# EAGLE design Arduino PCD8544 (EAGLE 8.0.0)
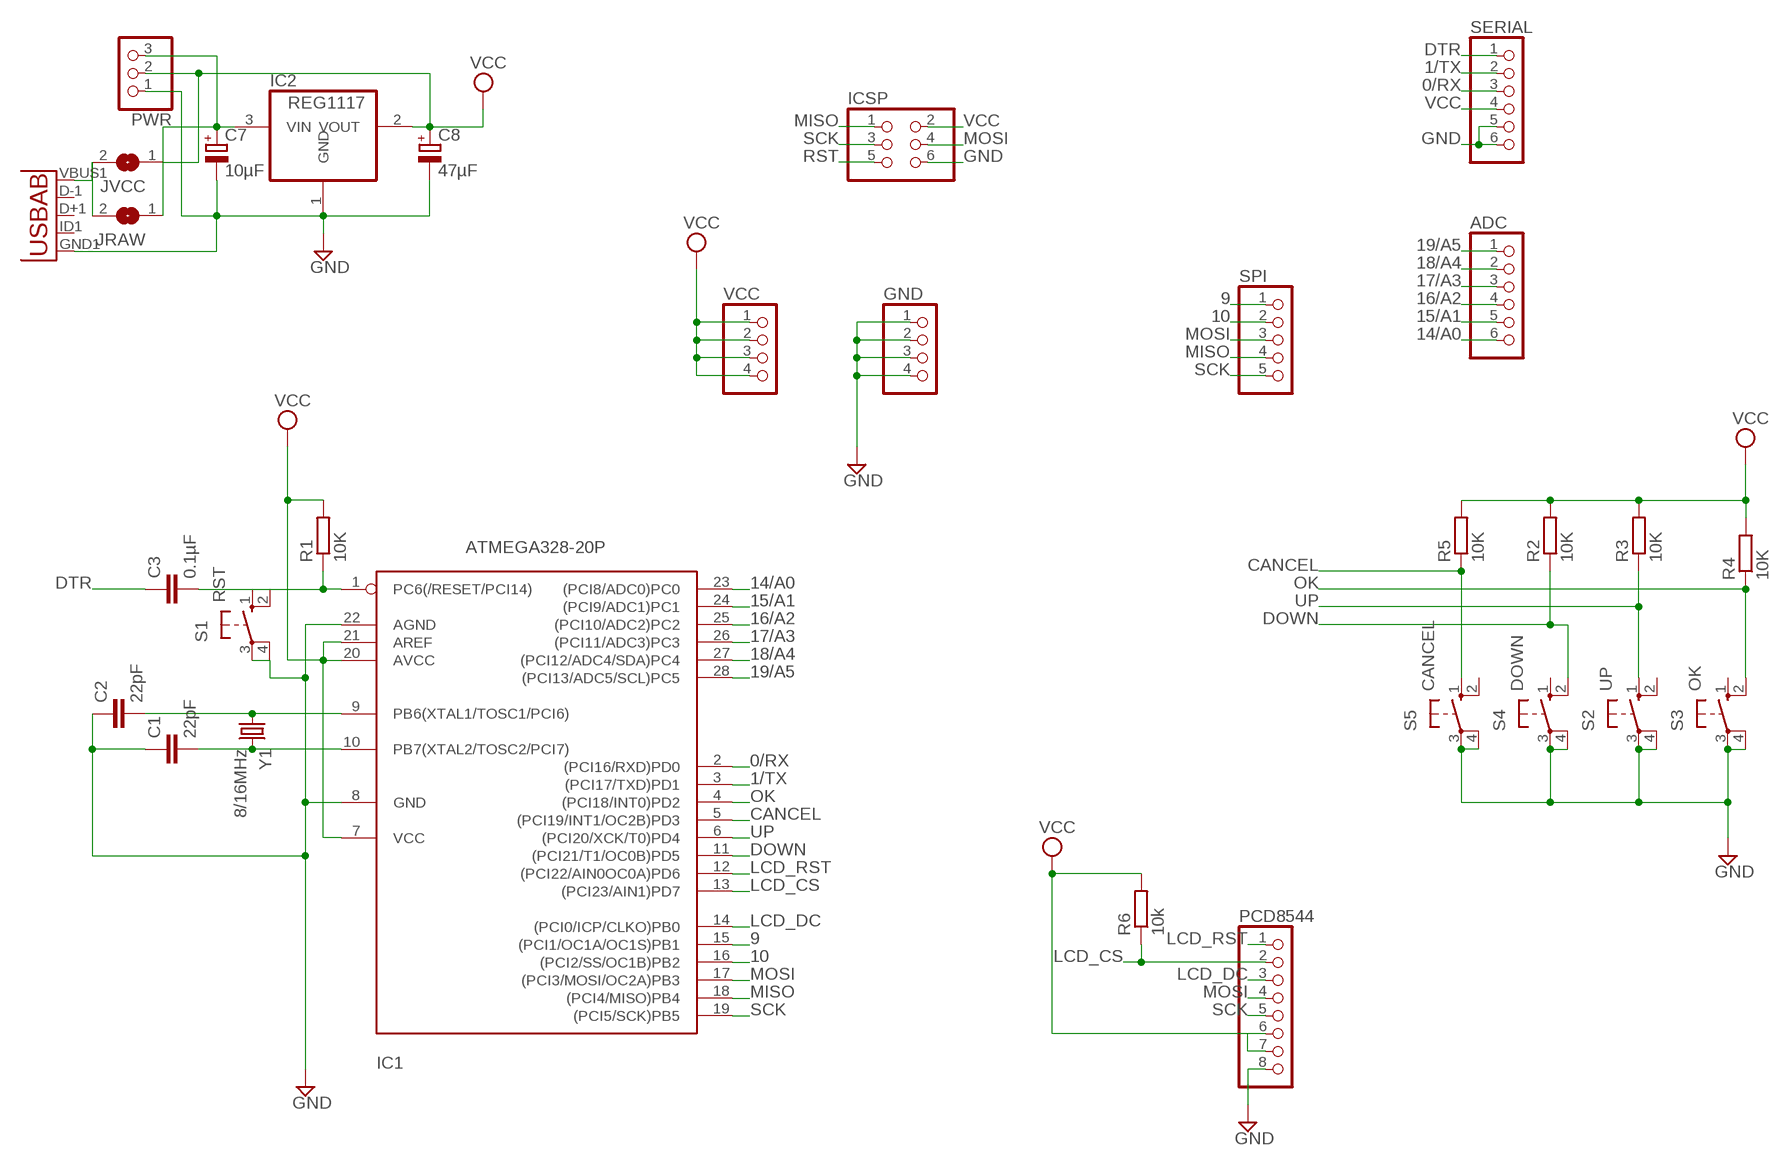
[diagram p0: schematic, sheet 1]

## Parts
ADC  PINHD-1X6  [1X06]
C1  22pF  C-EUC0805  [C0805]
C2  22pF  C-EUC0805  [C0805]
C3  0.1µF  C-EUC0805  [C0805]
C7  10µF  CPOL-EUE2.5-5  [E2,5-5]
C8  47µF  CPOL-EUE2.5-5  [E2,5-5]
GND  PINHD-1X4  [1X04]
IC1  ATMEGA328-20P  [DIL28-3]
IC2  REG1117  [SOT223]
ICSP  PINHD-2X3  [2X03]
JRAW  SJ  [SJ]
JVCC  SJ  [SJ]
PCD8544  PINHD-1X8  [1X08]
PWR  PINHD-1X3  [1X03]
R1  10K  R-EU_R0805  [R0805]
R2  10K  R-EU_R0805  [R0805]
R3  10K  R-EU_R0805  [R0805]
R4  10K  R-EU_R0805  [R0805]
R5  10K  R-EU_R0805  [R0805]
R6  10k  R-EU_R0805  [R0805]
S1  RST  10-XX  [B3F-10XX]
S2  UP  10-XX  [B3F-10XX]
S3  OK  10-XX  [B3F-10XX]
S4  DOWN  10-XX  [B3F-10XX]
S5  CANCEL  10-XX  [B3F-10XX]
SERIAL  PINHD-1X6  [1X06]
SPI  PINHD-1X5  [1X05]
U1  USB""  [USB-MICRO-SMD]
VCC  PINHD-1X4  [1X04]
Y1  8/16MHz  CRYSTALHC49US  [HC49US]

## Nets
0/RX: IC1.2((PCI16/RXD)PD0) SERIAL.3
1/TX: IC1.3((PCI17/TXD)PD1) SERIAL.2
9: IC1.15((PCI1/OC1A/OC1S)PB1) SPI.1
10: IC1.16((PCI2/SS/OC1B)PB2) SPI.2
14/A0: ADC.6 IC1.23((PCI8/ADC0)PC0)
15/A1: ADC.5 IC1.24((PCI9/ADC1)PC1)
16/A2: ADC.4 IC1.25((PCI10/ADC2)PC2)
17/A3: ADC.3 IC1.26((PCI11/ADC3)PC3)
18/A4: ADC.2 IC1.27((PCI12/ADC4/SDA)PC4)
19/A5: ADC.1 IC1.28((PCI13/ADC5/SCL)PC5)
CANCEL: IC1.5((PCI19/INT1/OC2B)PD3) R5.1 S5.1(S)
DOWN: IC1.11((PCI21/T1/OC0B)PD5) R2.1 S4.2(S1)
DTR: C3.1 SERIAL.1
GND: C1.1 C2.1 C7.- C8.- GND.1 GND.2 GND.3 GND.4 IC1.8(GND) IC1.22(AGND) IC2.1(GND) ICSP.6 PCD8544.8 PWR.1 S1.3(P) S1.4(P1) S2.3(P) S2.4(P1) S3.3(P) S3.4(P1) S4.3(P) S4.4(P1) S5.3(P) S5.4(P1) SERIAL.5 SERIAL.6 U1.GND1(GND)
LCD_CS: IC1.13((PCI23/AIN1)PD7) PCD8544.2 R6.1
LCD_DC: IC1.14((PCI0/ICP/CLKO)PB0) PCD8544.3
LCD_RST: IC1.12((PCI22/AIN0OC0A)PD6) PCD8544.1
MISO: IC1.18((PCI4/MISO)PB4) ICSP.1 SPI.4
MOSI: IC1.17((PCI3/MOSI/OC2A)PB3) ICSP.4 PCD8544.4 SPI.3
N$1: JRAW.2 JVCC.2 U1.VBUS1(VBUS)
OK: IC1.4((PCI18/INT0)PD2) R4.1 S3.2(S1)
RAW: C7.+ IC2.3(VIN) JRAW.1 PWR.3
RST: C3.2 IC1.1(PC6(/RESET/PCI14)) ICSP.5 R1.1 S1.1(S) S1.2(S1)
SCK: IC1.19((PCI5/SCK)PB5) ICSP.3 PCD8544.5 SPI.5
UP: IC1.6((PCI20/XCK/T0)PD4) R3.1 S2.1(S)
VCC: C8.+ IC1.7(VCC) IC1.20(AVCC) IC1.21(AREF) IC2.2(VOUT) ICSP.2 JVCC.1 PCD8544.6 PCD8544.7 PWR.2 R1.2 R2.2 R3.2 R4.2 R5.2 R6.2 SERIAL.4 VCC.1 VCC.2 VCC.3 VCC.4
XTAL1: C2.2 IC1.9(PB6(XTAL1/TOSC1/PCI6)) Y1.1
XTAL2: C1.2 IC1.10(PB7(XTAL2/TOSC2/PCI7)) Y1.2
Unconnected: S2.2(S1) S3.1(S) S4.1(S) S5.2(S1) U1.D+1(D+) U1.D-1(D-) U1.ID1(USBID)

## Library data of the parts
ADC SERIAL = pinhead:PINHD-1X6: PIN HEADER
C1-C3 = resistor:C-EU: CAPACITOR, European symbol
C7 C8 = resistor:CPOL-EU: POLARIZED CAPACITOR, European symbol
GND VCC = pinhead:PINHD-1X4: PIN HEADER
IC1 = atmega328:ATMEGA328*P: MICROCONTROLLER 32 kBytes FLASH 2 kBytes SRAM 1 kBytes EEPROM USART 8-channel 10 bit ADC
IC2 = burr-brown:REG1117: 800mA and 1A Low Dropout (LDO) Positive Regulator 1.8V, 2.5V, 2.85V, 3.3V, 5V, and Adj; MPN: REG1117; OC_FARNELL: 1097566; OC_NEWARK: 14P6981
ICSP = pinhead:PINHD-2X3: PIN HEADER
JRAW JVCC = jumper:SJ: SMD solder JUMPER
PCD8544 = pinhead:PINHD-1X8: PIN HEADER
PWR = pinhead:PINHD-1X3: PIN HEADER
R1 = rcl:R-EU_: RESISTOR, European symbol
R2-R6 = resistor:R-EU_: RESISTOR, European symbol
S1-S5 = switch-omron:10-XX: OMRON SWITCH; MPN: B3F-1000; OC_FARNELL: 176432; OC_NEWARK: 36M3542
SPI = pinhead:PINHD-1X5: PIN HEADER
U1 = MicroUSB:USB: This is a USB AB connector that is compatible with USB OTG. i.e. this connector can serve as a host or device
Y1 = SparkFun-FreqCtrl:CRYSTAL: Various standard crystals. Proven footprints.

## Board
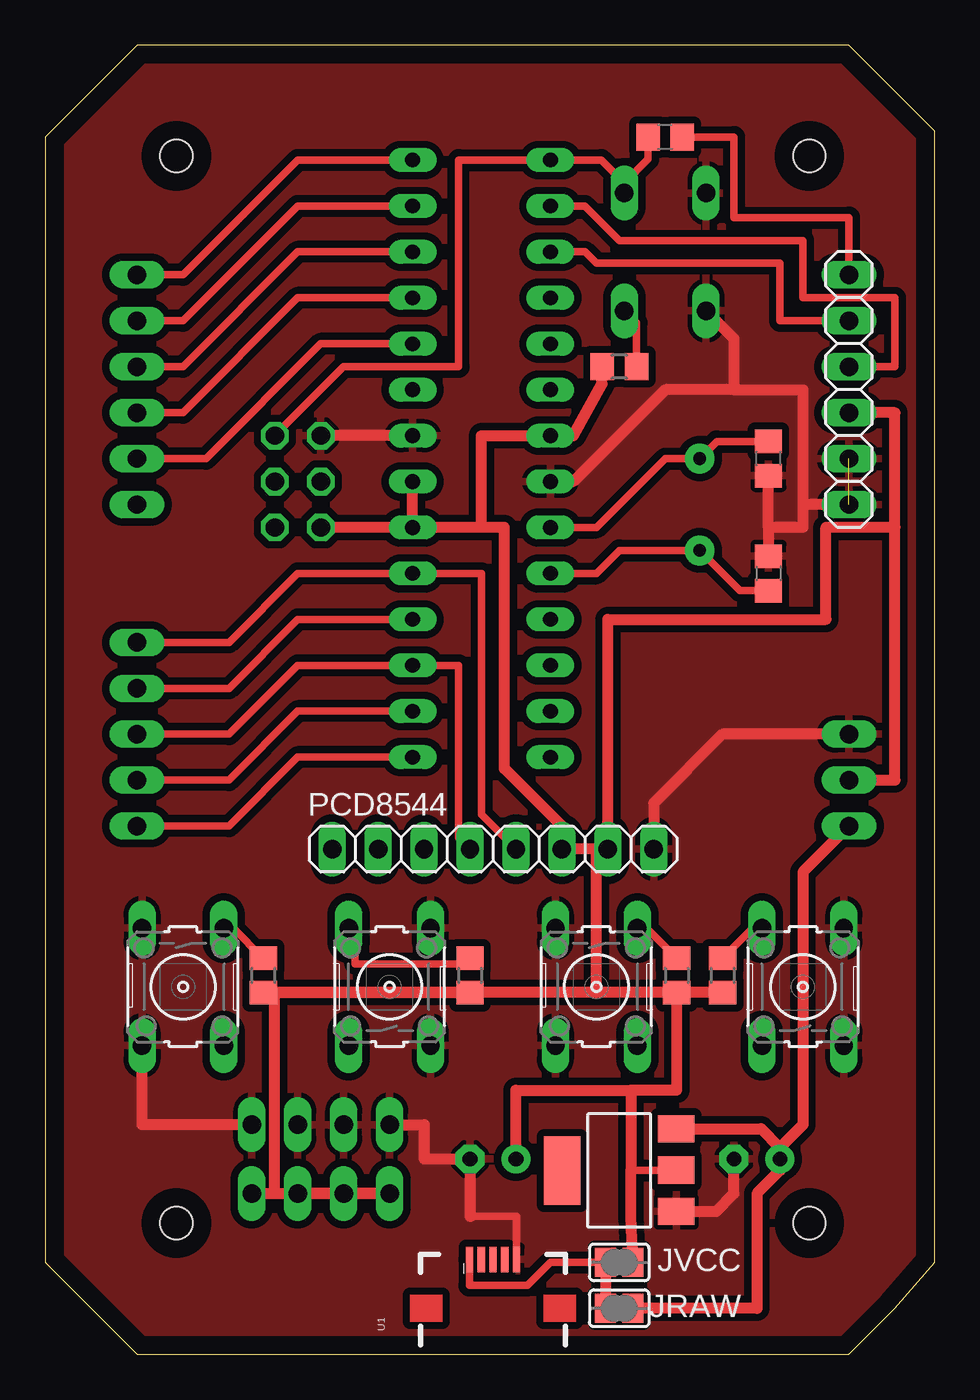
[diagram p1: board, top side]
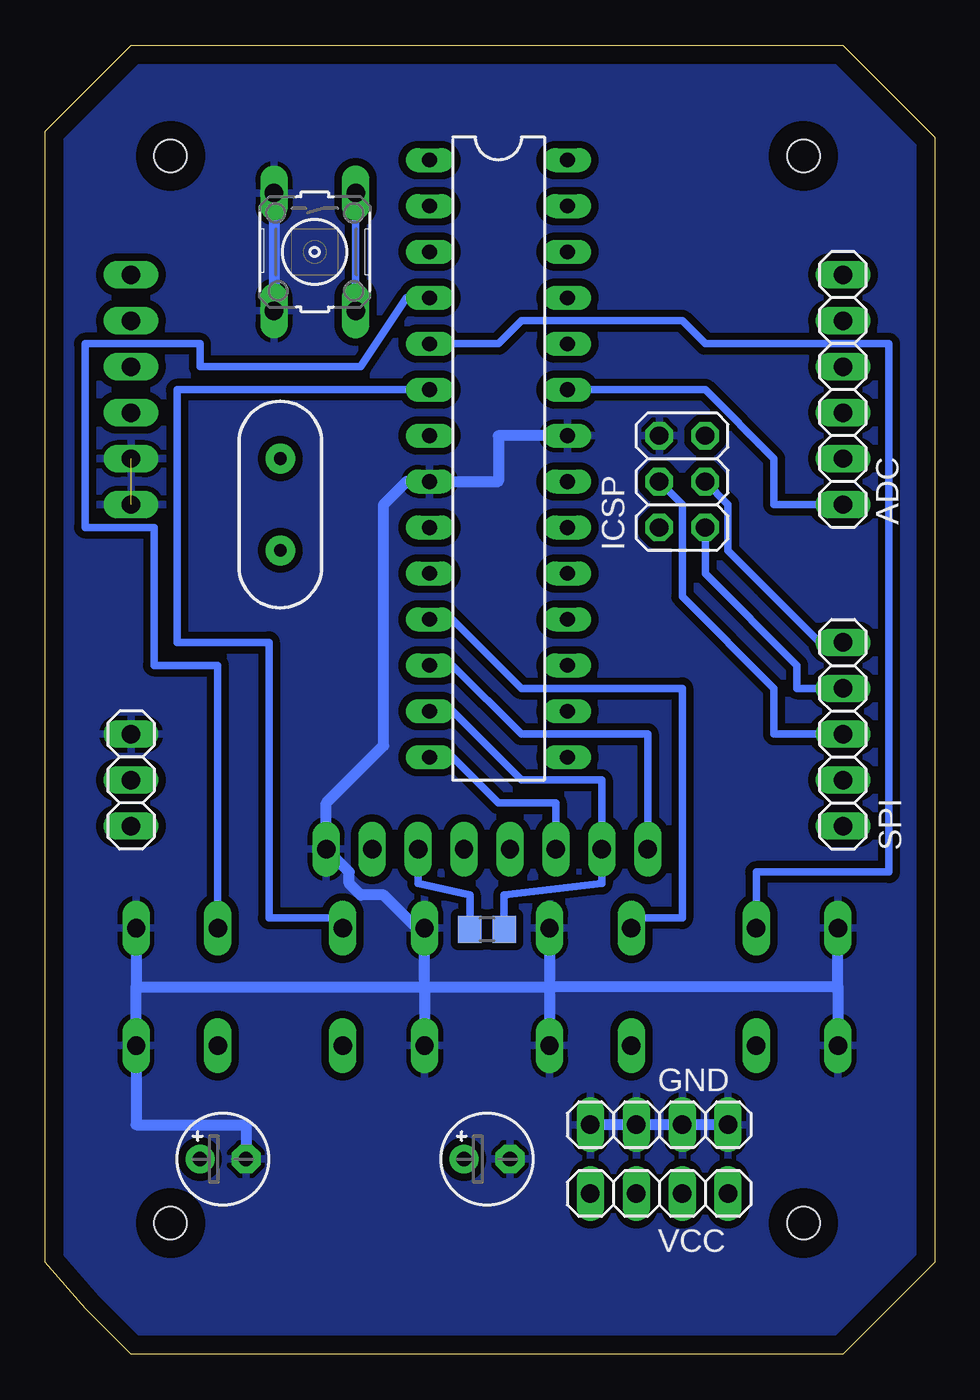
[diagram p2: board, bottom side, seen from below]

Size 49.2 x 72.39 mm. Coordinates in mm from the lower left corner, seen from the top.
Outline: 0,5.08 5.08,0 44.45,0 46.99,2.54 49.2,5.08 49.2,67.64 44.45,72.39 5.08,72.38 0,67.31 0,5.08
Copper layers (1*16): Top 0.035mm / dielectric 1.5mm / Bottom 0.035mm
Design rules "default": minimum track width 10mil, minimum drill 24mil, track to track 8mil, track to pad 8mil, pad to pad 8mil, via to via 8mil, smd to smd 8mil, copper to edge 40mil, drill to drill 8mil, minimum pad ring 10mil, minimum via ring 8mil, stop-mask expansion 4mil, vias tented up to drill 0mil, thermal gap 10mil
Holes 1.8 mm at 7.26,66.27 7.26,7.26 42.27,66.27 42.27,7.26

### Footprints (pad centres in the part's own frame; a part is rotated, then mirrored left to right if it is on the bottom)
1X06 = drill 1.016 long: 1 -6.35,0; 2 -3.81,0; 3 -1.27,0; 4 1.27,0; 5 3.81,0; 6 6.35,0
C0805 = smd 1.3 x 1.5: 1 -0.95,0; 2 0.95,0
E2,5-5 = drill 0.813 pad 1.6: + -1.27,0 | drill 0.813 pad 1.6 octagon: - 1.27,0
1X04 = drill 1.016 long: 1 -3.81,0; 2 -1.27,0; 3 1.27,0; 4 3.81,0
DIL28-3 = drill 0.813 long: 1 -16.51,-3.81; 2 -13.97,-3.81; 3 -11.43,-3.81; 4 -8.89,-3.81; 5 -6.35,-3.81; 6 -3.81,-3.81; 7 -1.27,-3.81; 8 1.27,-3.81; 9 3.81,-3.81; 10 6.35,-3.81; 11 8.89,-3.81; 12 11.43,-3.81; 13 13.97,-3.81; 14 16.51,-3.81; 15 16.51,3.81; 16 13.97,3.81; 17 11.43,3.81; 18 8.89,3.81; 19 6.35,3.81; 20 3.81,3.81; 21 1.27,3.81; 22 -1.27,3.81; 23 -3.81,3.81; 24 -6.35,3.81; 25 -8.89,3.81; 26 -11.43,3.81; 27 -13.97,3.81; 28 -16.51,3.81
SOT223 = smd 1.499 x 2.007: 1 -2.261,-3.15; 2 0.025,-3.15; 3 2.311,-3.15 | smd 3.81 x 2.007: 4 0,3.15
2X03 = drill 1.016 octagon: 1 -2.54,-1.27; 2 -2.54,1.27; 3 0,-1.27; 4 0,1.27; 5 2.54,-1.27; 6 2.54,1.27
SJ = smd 1.168 x 1.6: 1 -0.762,0; 2 0.762,0
1X08 = drill 1.016 long: 1 -8.89,0; 2 -6.35,0; 3 -3.81,0; 4 -1.27,0; 5 1.27,0; 6 3.81,0; 7 6.35,0; 8 8.89,0
1X03 = drill 1.016 long: 1 -2.54,0; 2 0,0; 3 2.54,0
R0805 = smd 1.3 x 1.5: 1 -0.95,0; 2 0.95,0
B3F-10XX = drill 1.016 long: 1 -3.251,2.261; 2 3.251,2.261; 3 -3.251,-2.261; 4 3.251,-2.261
1X05 = drill 1.016 long: 1 -5.08,0; 2 -2.54,0; 3 0,0; 4 2.54,0; 5 5.08,0
USB-MICRO-SMD = smd 1.4 x 0.4: D+1 2.7,0; D-1 2.7,0.65; GND1 2.7,-1.3; ID1 2.7,-0.65; VBUS1 2.7,1.3
HC49US = drill 0.7 pad 1.651: 1 -2.54,0; 2 2.54,0

### Placement (x,y rotation side)
ADC  5.08,53.34 270 bottom
C1  40.01,43.18 270 top
C2  40.01,49.53 90 top
C3  34.29,67.31 180 top
C7  39.37,10.79 0 bottom
C8  24.77,10.79 0 bottom
GND  15.24,12.7 0 bottom
IC1  24.13,49.53 270 bottom
IC2  31.75,10.16 90 top
ICSP  13.97,48.26 90 bottom
JRAW  31.75,2.54 180 top
JVCC  31.75,5.08 180 top
PCD8544  24.77,27.94 0 top
PWR  44.45,31.75 270 bottom
R1  31.75,54.61 180 top
R2  23.5,20.95 270 top
R3  34.92,20.95 270 top
R4  37.47,20.95 270 top
R5  12.06,20.95 270 top
R6  24.77,23.5 180 bottom
S1  34.29,60.96 270 bottom
S2  30.48,20.32 270 top
S3  41.91,20.32 90 top
S4  19.05,20.32 90 top
S5  7.62,20.32 270 top
SERIAL  44.45,53.34 270 top
SPI  5.08,34.29 90 bottom
U1  24.77,2.54 90 top
VCC  15.24,8.89 0 bottom
Y1  36.2,46.99 270 bottom

### Tracks (layer width: path | path; a pad name or v marks a point on that pad's centre or on a via)
0/RX
  Top 0.406: IC1.2 29.84,63.5 31.75,61.59 41.91,61.59 41.91,58.42 46.99,58.42 46.99,54.61 SERIAL.3
1/TX
  Top 0.406: IC1.3 29.84,60.96 30.48,60.33 40.64,60.33 40.64,57.15 SERIAL.2
9
  Top 0.406: IC1.15 13.97,33.02 10.16,29.21 SPI.1
10
  Top 0.406: IC1.16 13.97,35.56 10.16,31.75 SPI.2
14/A0
  Bottom 0.406: IC1.23 12.7,53.34 8.89,49.53 8.89,46.99 ADC.6
15/A1
  Top 0.406: IC1.24 15.24,55.88 8.89,49.53 ADC.5
16/A2
  Top 0.406: IC1.25 13.97,58.42 7.62,52.07 ADC.4
17/A3
  Top 0.406: IC1.26 13.97,60.96 7.62,54.61 ADC.3
18/A4
  Top 0.406: IC1.27 13.97,63.5 7.62,57.15 ADC.2
19/A5
  Top 0.406: IC1.28 13.97,66.04 7.62,59.69 ADC.1
CANCEL
  Top 0.406: R5.1 10.4,23.57 S5.1
  Bottom 0.406: IC1.5 24.13,55.88 22.86,57.15 13.97,57.15 12.7,55.88 2.54,55.88 2.54,26.67 9.88,26.67 S5.1
DOWN
  Top 0.406: R2.1 23.5,21.59 17.14,21.59 17.14,23.57 S4.2
  Bottom 0.406: IC1.11 26.67,40.64 22.86,36.83 13.97,36.83 13.97,24.13 16.79,24.13 S4.2
DTR
  Top 0.406: C3.1 38.1,67.31 38.1,62.87 44.45,62.87 SERIAL.1
GND  (1 unrouted)
  Top 0.406: U1.GND1 26.07,7.62 23.5,7.62
  Top 0.61: IC1.22 ICSP.6 | 40.01,45.72 C2.1 | 40.01,45.72 C1.1 | IC1.8 29.21,48.26 34.29,53.34 38.1,53.34 | 38.1,53.34 41.91,53.34 41.91,46.99 | 41.91,46.99 41.91,45.72 40.01,45.72 | S1.4 38.1,56.16 38.1,53.34 | SERIAL.6 41.91,46.99 | GND.4 5.36,12.7 S5.4 | 23.5,7.62 C8.- 20.95,10.79 20.95,12.7 GND.1 | PWR.1 37.47,34.29 33.66,30.48 PCD8544.8 | IC2.1 37.11,7.9 38.1,8.89 C7.-
  Bottom 0.61: S1.3 S1.4 | IC1.22 24.13,50.8 24.13,48.26 IC1.8 29.21,48.26 30.48,46.99 30.48,33.66 33.66,30.48 PCD8544.8 32.38,26.67 32.38,26.04 31.75,25.4 30.48,25.4 28.65,23.57 S2.3 28.22,20.32 | 5.36,20.32 S5.3 | 5.36,20.32 S5.4 | S4.4 21.31,20.32 | 21.31,20.32 S4.3 | 28.22,20.32 S2.4 | S3.4 44.17,20.32 | S3.3 44.17,20.32 | 44.17,20.32 28.22,20.32 | 28.22,20.32 21.31,20.32 | 5.36,20.32 21.31,20.32 | GND.4 GND.3 GND.2 GND.1 | 44.45,16.79 S3.3 | S3.3 44.17,12.7 38.1,12.7 C7.-
  pour Top (isolate 0.406): 0,67.31 5.08,72.39 44.45,72.39 49.53,67.31 49.53,5.08 44.45,0 5.08,0 0,5.08
  pour Bottom (isolate 0.406): 0,67.31 5.08,72.39 44.45,72.39 49.53,67.31 49.53,5.08 44.45,0 5.08,0 0,5.08
LCD_CS
  Bottom 0.406: IC1.13 26.67,35.56 22.86,31.75 18.41,31.75 PCD8544.2 18.41,26.04 23.82,25.4 R6.1
LCD_DC
  Bottom 0.406: IC1.14 26.67,33.02 24.13,30.48 20.95,30.48 PCD8544.3
LCD_RST
  Bottom 0.406: IC1.12 26.67,38.1 22.86,34.29 15.88,34.29 PCD8544.1
MISO
  Top 0.406: IC1.18 13.97,40.64 10.16,36.83 SPI.4
  Bottom 0.406: ICSP.1 12.7,43.18 7.62,38.1 7.62,36.83 SPI.4
MOSI
  Top 0.406: PCD8544.4 22.86,28.57 22.86,38.1 IC1.17 13.97,38.1 10.16,34.29 SPI.3
  Bottom 0.406: ICSP.4 13.97,46.99 13.97,41.91 8.89,36.83 8.89,34.29 SPI.3
N$1
  Top 0.406: U1.VBUS1 23.46,3.81 26.67,3.81 27.94,5.08 JVCC.2
  Top 0.61: JVCC.2 JRAW.2
N$2
  pour Top (isolate 0.406): 0,67.31 5.08,72.39 44.45,72.39 49.53,67.31 49.53,5.08 44.45,0 5.08,0 0,5.08
N$3
  pour Bottom (isolate 0.406): 0,67.31 5.08,72.39 44.45,72.39 49.53,67.31 49.53,5.08 44.45,0 5.08,0 0,5.08
OK
  Top 0.406: R4.1 39.13,23.57 S3.2
  Bottom 0.406: IC1.4 29.21,58.42 31.75,54.61 40.64,54.61 40.64,55.88 46.99,55.88 46.99,45.72 43.18,45.72 43.18,38.1 39.65,38.1 S3.2
RAW
  Top 0.61: PWR.3 41.91,26.67 41.91,12.7 40.64,11.43 | JRAW.1 39.37,2.54 39.37,8.89 40.64,10.16 C7.+ 40.64,11.43 | 40.64,11.43 39.6,12.47 IC2.3
RST
  Top 0.406: ICSP.5 16.51,54.61 22.86,54.61 22.86,66.04 IC1.1 30.76,66.04 32.03,64.77 | 32.03,64.77 S1.1 | R1.1 32.7,57.04 S1.2 | C3.2 33.34,66.08 32.03,64.77
  Bottom 0.406: S1.1 S1.2
SCK
  Top 0.406: PCD8544.5 24.13,29.84 24.13,43.18 IC1.19 13.97,43.18 10.16,39.37 SPI.5
  Bottom 0.406: ICSP.3 11.43,46.99 11.43,44.45 6.35,39.37 SPI.5
UP
  Top 0.406: R3.1 33.26,23.57 S2.1
  Bottom 0.406: IC1.6 41.91,53.34 41.91,39.37 36.83,39.37 36.83,24.13 33.02,24.13 33.02,22.86 32.74,22.86 S2.1
VCC
  Top 0.406: 32.38,10.16 34.92,10.19 IC2.2
  Top 0.61: IC1.20 ICSP.2 | IC1.20 IC1.21 | 24.13,45.72 25.4,45.72 25.4,32.38 28.57,29.21 PCD8544.6 30.48,27.94 | 24.13,45.72 IC1.20 | 24.13,45.72 24.13,50.8 IC1.7 29.21,50.8 30.8,53.66 R1.2 | R2.2 R5.2 | R3.2 30.48,20 | 30.48,20 R2.2 | R4.2 R3.2 | 30.48,27.94 PCD8544.7 31.11,40.64 43.18,40.64 43.18,45.72 46.99,45.72 | 46.99,45.72 46.99,52.07 SERIAL.4 | JVCC.1 32.38,7.62 32.38,10.16 32.38,14.61 | VCC.4 12.7,8.89 | 12.7,8.89 VCC.3 | VCC.3 VCC.2 VCC.1 VCC.3 | 12.7,8.89 12.7,20 R2.2 | 32.38,14.61 34.92,14.61 R3.2 | C8.+ 26.04,14.61 32.38,14.61 | 30.48,20 30.48,27.94 | PWR.2 46.99,31.75 46.99,45.72
  Bottom 0.406: PCD8544.6 28.57,26.04 25.71,25.4 R6.2
XTAL1
  Top 0.406: IC1.9 30.48,45.72 34.29,49.53 Y1.1 37.15,50.48 C2.2
XTAL2
  Top 0.406: IC1.10 30.48,43.18 31.75,44.45 Y1.2 38.41,42.23 C1.2

### Text on the board
bValues: 19/A5 / 18/A4 / 17/A3 / 16/A2 / 15/A1 / 14/A0 | DTR / TX / RX / VCC / CTS / GND | GND / VCC / RAW | SCK / MISO / MOSI / ~ 10 / ~ 9